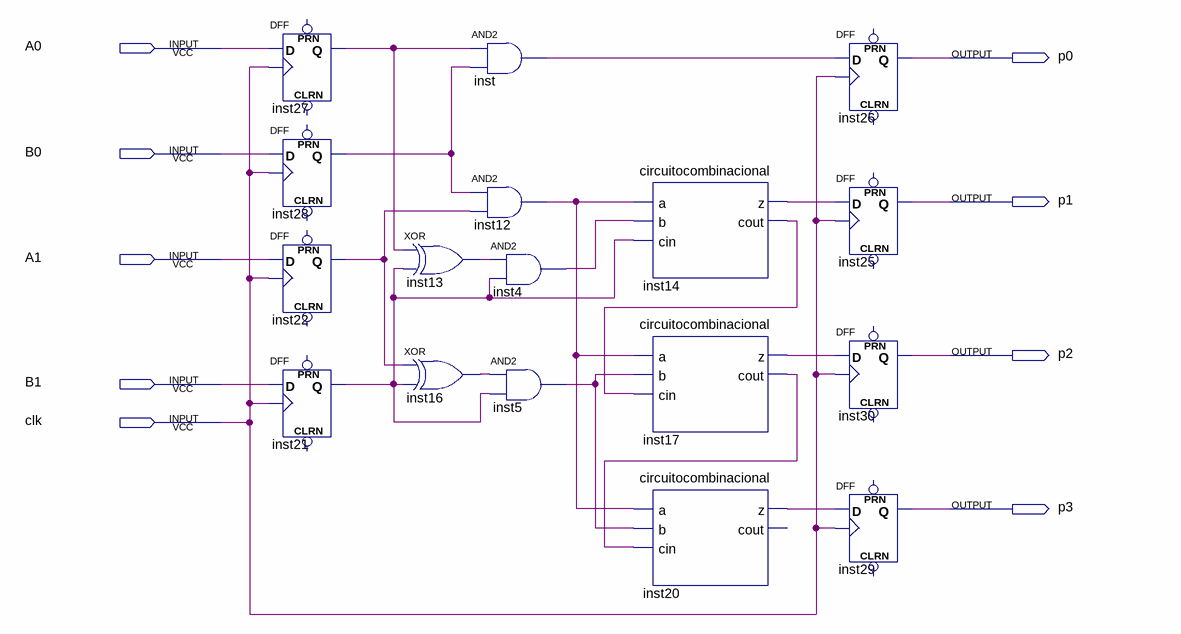
[diagram p0: schematic sheet]
// Quartus schematic MultiplicadorConSigno.bdf as structural Verilog: 17 symbols, 9 pins
module MultiplicadorConSigno (
  input  A0,
  input  B0,
  input  A1,
  input  B1,
  input  clk,
  output p0,
  output p1,
  output p2,
  output p3
);

  wire inst4_out, inst5_out, inst12_out, inst13_out, inst14_cout, inst14_z, inst16_out, inst17_cout,
       inst17_z, inst20_z, inst21_q, inst22_q, inst27_q, inst28_q, inst_out;

  DFF inst27 (.CLK(clk), .D(A0), .Q(inst27_q));  // open: CLRN, PRN
  DFF inst28 (.CLK(clk), .D(B0), .Q(inst28_q));  // open: CLRN, PRN
  DFF inst22 (.CLK(clk), .D(A1), .Q(inst22_q));  // open: CLRN, PRN
  DFF inst21 (.CLK(clk), .D(B1), .Q(inst21_q));  // open: CLRN, PRN
  xor inst13 (inst13_out, inst27_q, inst21_q);
  xor inst16 (inst16_out, inst22_q, inst21_q);
  and inst (inst_out, inst27_q, inst28_q);
  and inst12 (inst12_out, inst28_q, inst22_q);
  and inst4 (inst4_out, inst13_out, inst21_q);
  and inst5 (inst5_out, inst16_out, inst21_q);
  circuitocombinacional inst14 (.a(inst12_out), .b(inst4_out), .cin(inst21_q), .z(inst14_z), .cout(inst14_cout));
  circuitocombinacional inst17 (.a(inst12_out), .b(inst5_out), .cin(inst14_cout), .z(inst17_z), .cout(inst17_cout));
  circuitocombinacional inst20 (.a(inst12_out), .b(inst5_out), .cin(inst17_cout), .z(inst20_z));  // open: cout
  DFF inst26 (.CLK(clk), .D(inst_out), .Q(p0));  // open: CLRN, PRN
  DFF inst25 (.CLK(clk), .D(inst14_z), .Q(p1));  // open: CLRN, PRN
  DFF inst30 (.CLK(clk), .D(inst17_z), .Q(p2));  // open: CLRN, PRN
  DFF inst29 (.CLK(clk), .D(inst20_z), .Q(p3));  // open: CLRN, PRN
endmodule
